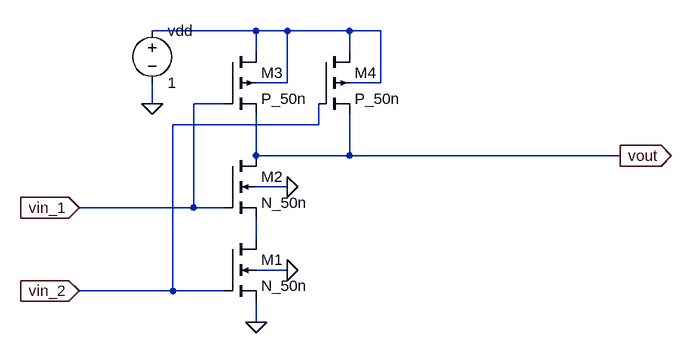
[diagram p0: schematic nand.asc]
nand.asc, the LTspice schematic file:
Version 4
SHEET 1 880 680
WIRE 208 -96 48 -96
WIRE 256 -96 208 -96
WIRE 352 -96 256 -96
WIRE 400 -96 352 -96
WIRE 208 -64 208 -96
WIRE 352 -64 352 -96
WIRE 256 -16 256 -96
WIRE 256 -16 208 -16
WIRE 400 -16 400 -96
WIRE 400 -16 352 -16
WIRE 48 16 48 -16
WIRE 160 16 112 16
WIRE 304 48 304 16
WIRE 304 48 80 48
WIRE 208 96 208 32
WIRE 352 96 352 32
WIRE 352 96 208 96
WIRE 768 96 352 96
WIRE 256 144 208 144
WIRE 112 176 112 16
WIRE 112 176 -64 176
WIRE 160 176 112 176
WIRE 208 224 208 192
WIRE 256 272 208 272
WIRE 80 304 80 48
WIRE 80 304 -64 304
WIRE 160 304 80 304
WIRE 208 352 208 320
FLAG 256 144 0
FLAG 256 272 0
FLAG 208 352 0
FLAG -64 176 vin_1
IOPIN -64 176 In
FLAG -64 304 vin_2
IOPIN -64 304 In
FLAG 768 96 vout
IOPIN 768 96 Out
FLAG 48 16 0
SYMBOL nmos4 160 224 R0
SYMATTR InstName M1
SYMATTR Value2 l=50n w=500n
SYMATTR Value N_50n
SYMBOL nmos4 160 96 R0
SYMATTR InstName M2
SYMATTR Value2 l=50n w=500n
SYMATTR Value N_50n
SYMBOL pmos4 160 -64 R0
SYMATTR InstName M3
SYMATTR Value2 l=50n w=1u
SYMATTR Value P_50n
SYMBOL pmos4 304 -64 R0
SYMATTR InstName M4
SYMATTR Value2 l=50n w=1u
SYMATTR Value P_50n
SYMBOL voltage 48 -112 R0
WINDOW 123 0 0 Left 0
WINDOW 39 0 0 Left 0
SYMATTR InstName vdd
SYMATTR Value 1

The netlist it stands for:
* nand.asc
M1 N002 vin_2 0 0 N_50n l=50n w=500n
M2 vout vin_1 N002 0 N_50n l=50n w=500n
M3 N001 vin_1 vout N001 P_50n l=50n w=1u
M4 N001 vin_2 vout N001 P_50n l=50n w=1u
vdd N001 0 1
.model NMOS NMOS
.model PMOS PMOS
.lib standard.mos
.backanno
.end